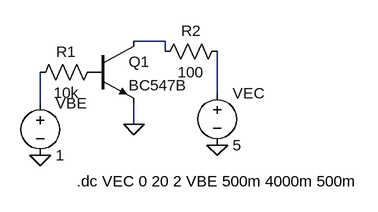
[diagram p0: schematic Draft5.asc]
Draft5.asc, the LTspice schematic file:
Version 4
SHEET 1 880 680
WIRE 464 192 416 192
WIRE 464 208 464 192
WIRE 544 272 544 208
WIRE 272 288 272 240
WIRE 416 320 416 288
FLAG 272 368 0
FLAG 544 352 0
FLAG 416 320 0
SYMBOL voltage 272 272 R0
SYMATTR InstName VBE
SYMATTR Value 1
SYMBOL voltage 544 256 R0
SYMATTR InstName VEC
SYMATTR Value 5
SYMBOL res 368 224 R90
WINDOW 0 0 56 VBottom 2
WINDOW 3 32 56 VTop 2
SYMATTR InstName R1
SYMATTR Value 10k
SYMBOL res 560 192 R90
WINDOW 0 0 56 VBottom 2
WINDOW 3 32 56 VTop 2
SYMATTR InstName R2
SYMATTR Value 100
SYMBOL npn 352 192 R0
SYMATTR InstName Q1
SYMATTR Value BC547B
TEXT 328 408 Left 2 !.dc VEC 0 20 2 VBE 500m 4000m 500m

The netlist it stands for:
* Draft5.asc
VBE N003 0 1
VEC N002 0 5
R1 P001 N003 10k
R2 N002 N001 100
Q1 N001 P001 0 0 BC547B
.model NPN NPN
.model PNP PNP
.lib standard.bjt
.dc VEC 0 20 2 VBE 500m 4000m 500m
.backanno
.end